# Altium schematic sheet Digit_Board_add.SchDoc
size A
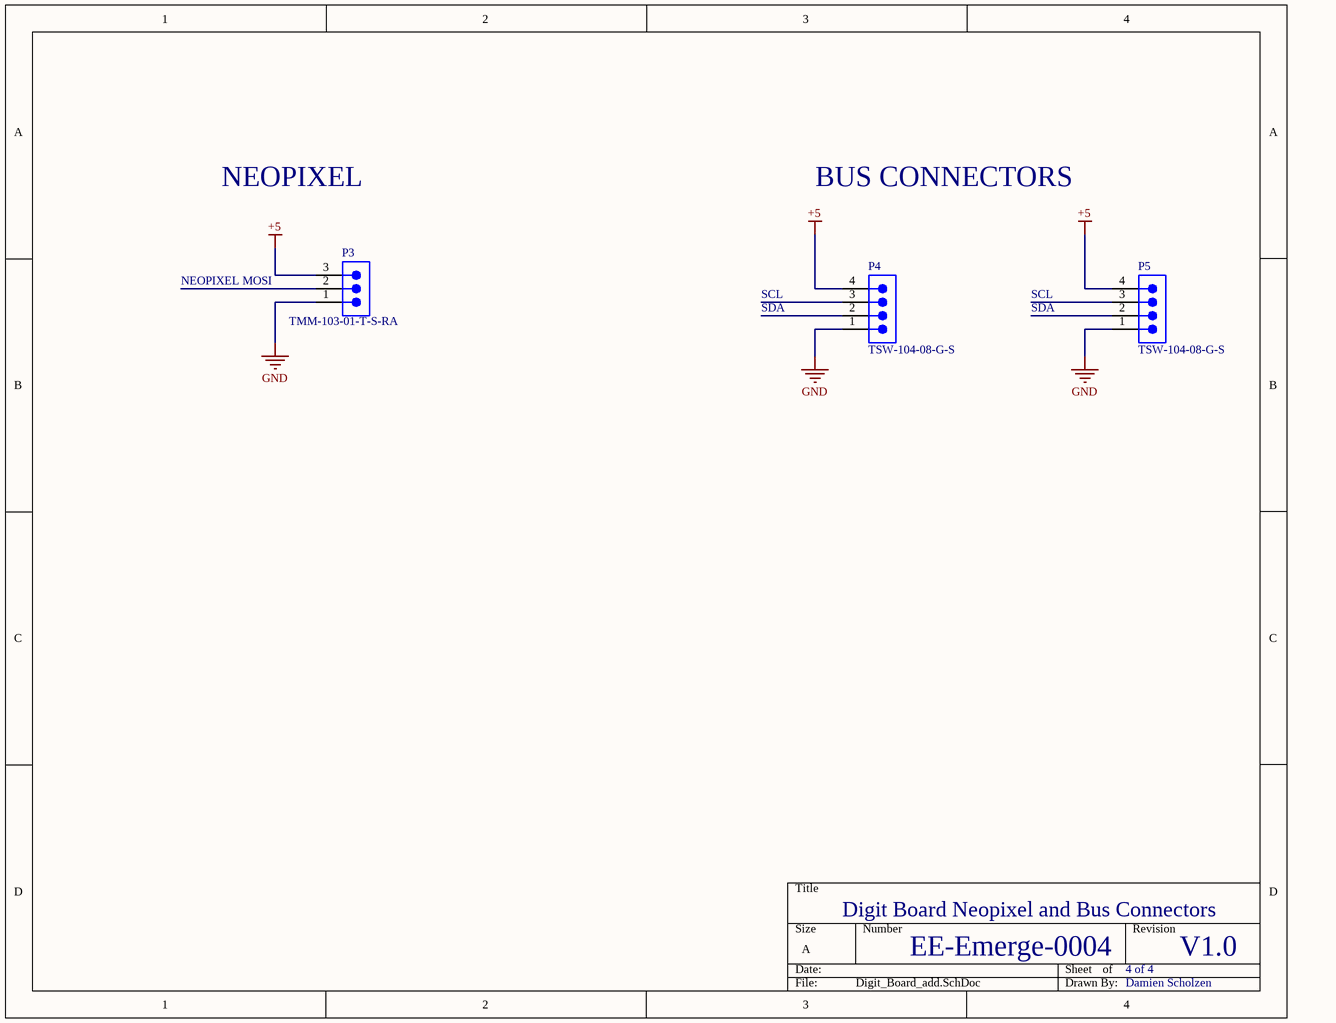
[diagram p0: Digit_Board_add.SchDoc]

## Parts
P3  TMM-103-01-T-S-RA  [SMTC-TMM-103-01-X-S-RA]
P4  TSW-104-08-G-S  [SMTC-TSW-104-08-X-S]
P5  TSW-104-08-G-S  [SMTC-TSW-104-08-X-S]

## Nets
+5: P3.3 P4.4 P5.4
GND: P3.1 P4.1 P5.1

Not connected (* = marked no-connect by the designer): P3 2; P4 2 3; P5 2 3

## Notes on the sheet
- NEOPIXEL
- BUS CONNECTORS
- NEOPIXEL MOSI
- SCL
- SDA
- Digit Board Neopixel and Bus Connectors
- EE-Emerge-0004
- 4 of 4
- V1.0
- Damien Scholzen

## Library data of the parts
P3 = CMP-1029-00176-1: Low Profile Through-Hole Header, Right Angle, -55 to 105 degC, 2 mm Pitch, 3-Pin, Male, RoHS; Manufacturer: Samtec; Pitch: 2 mm; PackageDescription: 2 mm Terminal Strip Assembly (R/A); Mounting Technology: Through-hole; ComponentLink3URL: http://www.samtec.com/documents/webfiles/cpdf/TMM-1XX-XX-XX-X-RA-XXX-MKT.pdf; RoHS: True; Temperature Range: -55 to 105 degC; PackageVersion: V, 3/2013; ComponentLink3Description: Package Specification; ComponentLink1Description: Manufacturer URL; ComponentLink2Description: Datasheet; PackageReference: TMM-103-01-X-S-RA; ComponentLink1URL: http://www.samtec.com; PartNumber: TMM-103-01-T-S-RA; DatasheetVersion: F-214; Orientation: Right Angle; ComponentLink2URL: http://d2a072wq521u33.cloudfront.net/catalog_english//TMM_TH.PDF; Manufacturer 1: Samtec; Manufacturer Part Number 1: TMM-103-01-T-S-RA
P4 P5 = CMP-1024-00357-1: 0.025" SQ Post Header, Through-hole, Vertical, -55 to 125 degC, 2.54 mm Pitch, 4-Pin, Male, RoHS; Manufacturer: Samtec; Pitch: 2.54 mm; RoHS: True; ComponentLink3URL: http://www.samtec.com/documents/webfiles/cpdf/TSW-XXX-XX-XXX-X-XX-XXX-MKT.pdf; Mounting Technology: Through-hole; ComponentLink2URL: http://www.samtec.com/documents/webfiles/pdf/TSW_TH.PDF; ComponentLink1URL: http://www.samtec.com; ComponentLink3Description: Package Specification; PackageVersion: DM, 8/1988; ComponentLink2Description: Datasheet; PackageReference: TSW-104-08-X-S; PackageDescription: .025[0.64] SQ. Post Terminal Strip Assembly; PartNumber: TSW-104-08-G-S; ComponentLink1Description: Manufacturer URL; Temperature Range: -55 to 125 degC; DatasheetVersion: F-214; Orientation: Vertical